# EAGLE design Schematico (EAGLE 7.2.0)
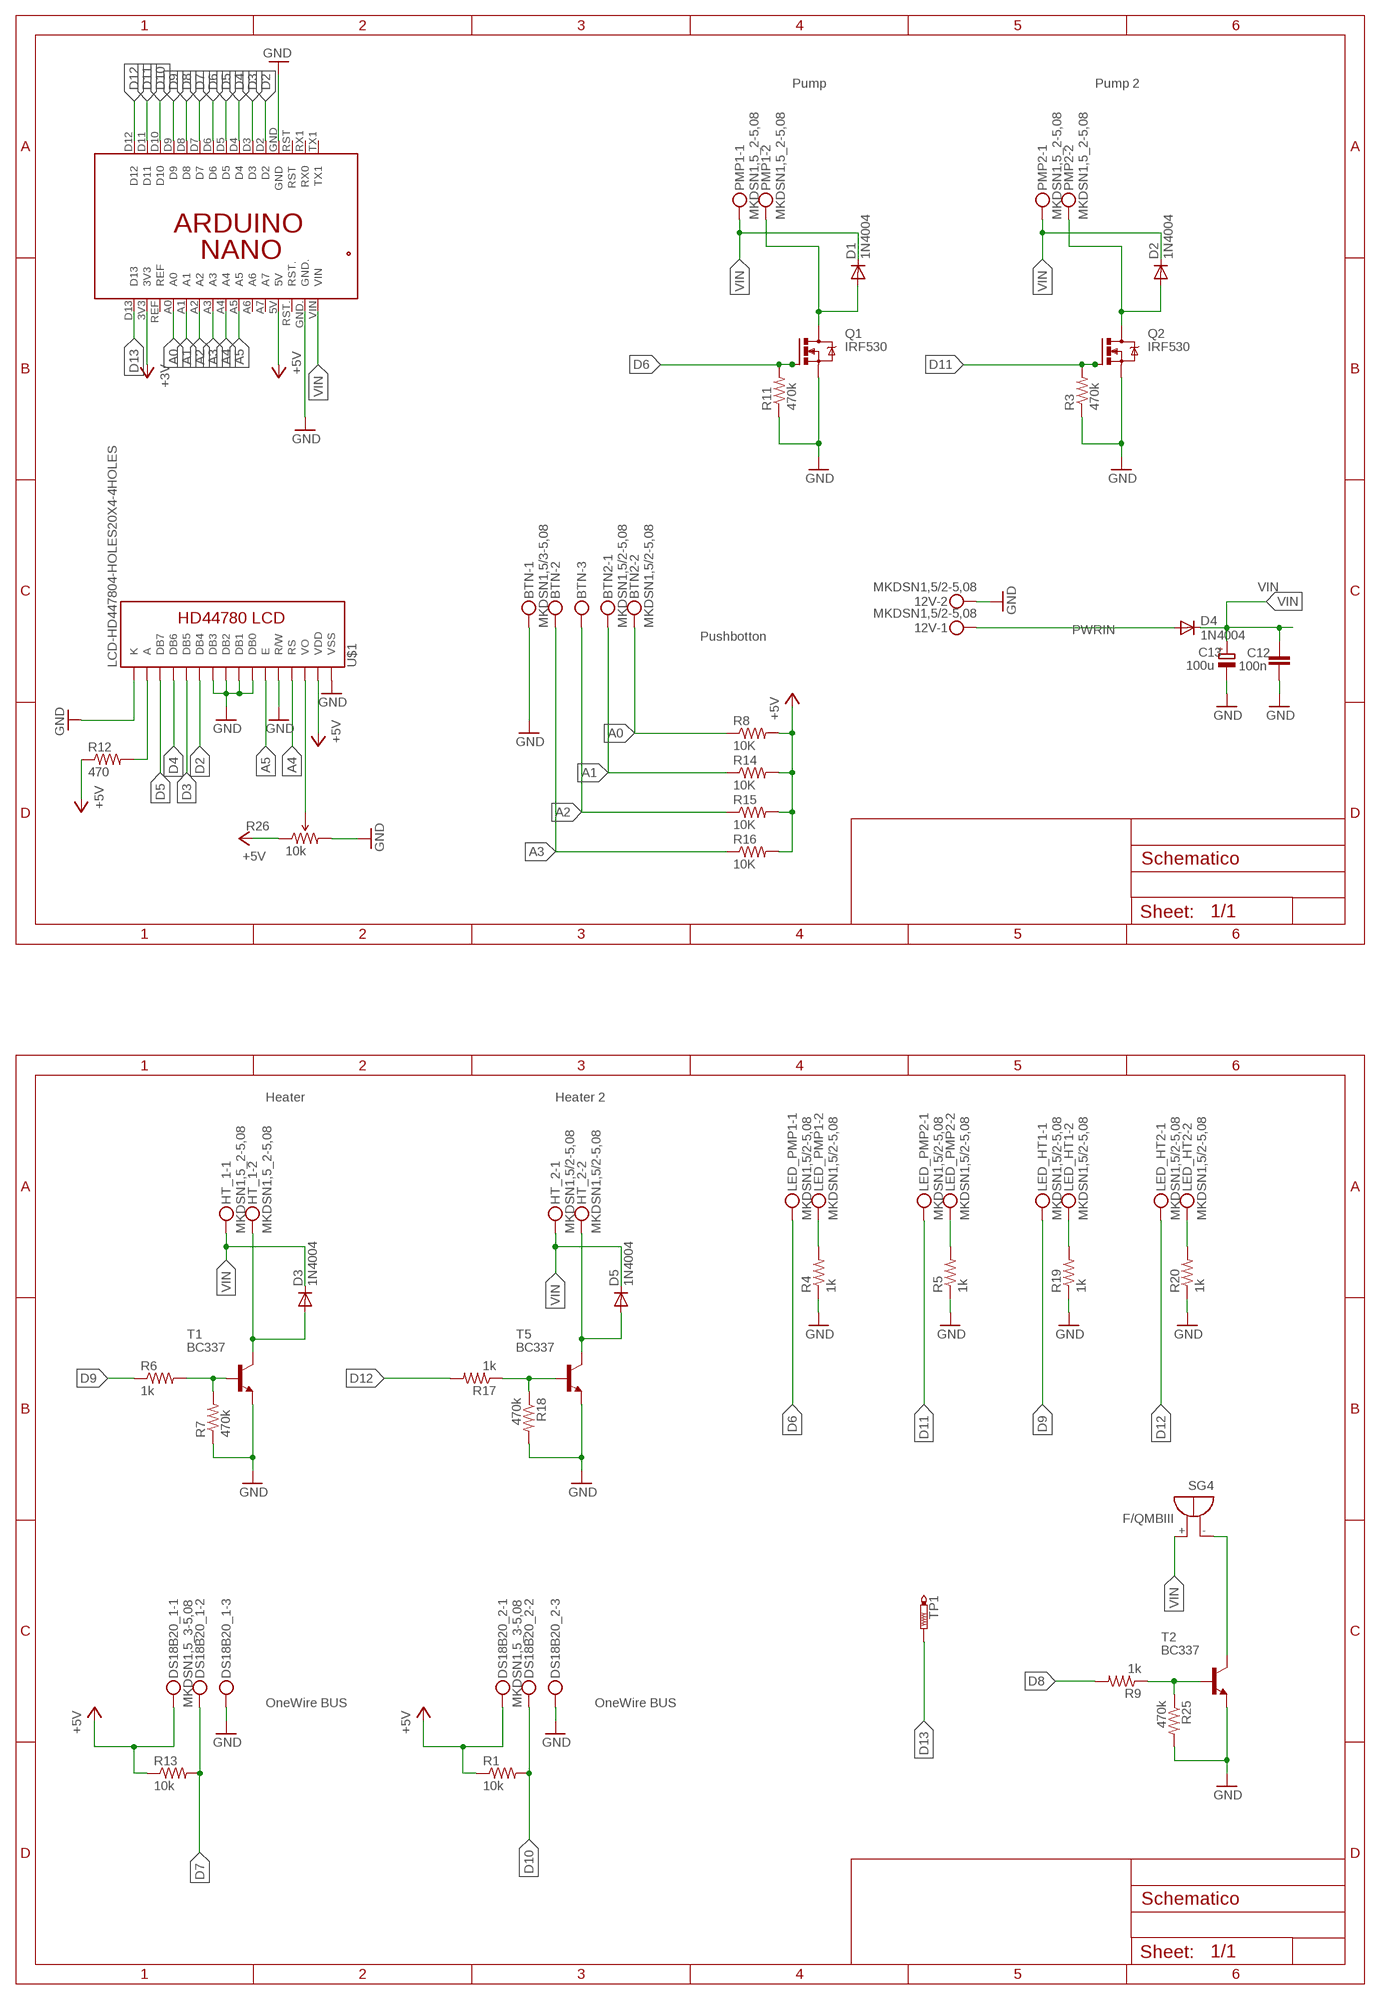
[diagram p0: schematic, sheet 1]

## Parts
12V  MKDSN1,5/2-5,08  [MKDSN1,5/2-5,08]
BTN  MKDSN1,5/3-5,08  [MKDSN1,5/3-5,08]
BTN2  MKDSN1,5/2-5,08  [MKDSN1,5/2-5,08]
C12  100n  C-EU050-024X044  [C050-024X044]
C13  100u  CPOL-EUTT6D6  [TT5D6]
D1  1N4004  [DO41-10]
D2  1N4004  [DO41-10]
D3  1N4004  [DO41-10]
D4  1N4004  [DO41-10]
D5  1N4004  [DO41-10]
DS18B20_1  MKDSN1,5_3-5,08  [MKDSN1,5-3-5,08]
DS18B20_2  MKDSN1,5_3-5,08  [MKDSN1,5-3-5,08]
HT_1  MKDSN1,5_2-5,08  [MKDSN1,5-2-5,08]
HT_2  MKDSN1,5/2-5,08  [MKDSN1,5/2-5,08]
LED_HT1  MKDSN1,5/2-5,08  [MKDSN1,5/2-5,08]
LED_HT2  MKDSN1,5/2-5,08  [MKDSN1,5/2-5,08]
LED_PMP1  MKDSN1,5/2-5,08  [MKDSN1,5/2-5,08]
LED_PMP2  MKDSN1,5/2-5,08  [MKDSN1,5/2-5,08]
PCB1  ARDUINO_NANO  [ARDUINO_NANO]
PMP1  MKDSN1,5_2-5,08  [MKDSN1,5-2-5,08]
PMP2  MKDSN1,5_2-5,08  [MKDSN1,5-2-5,08]
Q1  IRF530  [TO220BV]
Q2  IRF530  [TO220BV]
R1  10k  R-US_0207/10  [0207/10]
R3  470k  R-US_0207/10  [0207/10]
R4  1k  R-US_0207/10  [0207/10]
R5  1k  R-US_0207/10  [0207/10]
R6  1k  R-US_0207/10  [0207/10]
R7  470k  R-US_0207/10  [0207/10]
R8  10K  R-US_0207/10  [0207/10]
R9  1k  R-US_0207/10  [0207/10]
R11  470k  R-US_0207/10  [0207/10]
R12  470  R-US_0207/10  [0207/10]
R13  10k  R-US_0207/10  [0207/10]
R14  10K  R-US_0207/10  [0207/10]
R15  10K  R-US_0207/10  [0207/10]
R16  10K  R-US_0207/10  [0207/10]
R17  1k  R-US_0207/10  [0207/10]
R18  470k  R-US_0207/10  [0207/10]
R19  1k  R-US_0207/10  [0207/10]
R20  1k  R-US_0207/10  [0207/10]
R25  470k  R-US_0207/10  [0207/10]
R26  10k  TRIMPOT3362U-2  [3362U-2]
SG4  F/QMBIII  [F/QMBIII]
T1  BC337  [TO92]
T2  BC337  [TO92]
T5  BC337  [TO92]
TP1  PTR1PAD1-20  [P1-20]
U$1  LCD-HD447804-HOLES20X4-4HOLES  [LCD-20X4-4HOLES]

## Nets
+3V: PCB1.3V3
+5V [+5V]: DS18B20_1.1 DS18B20_2.1 PCB1.5V R1.1 R8.2 R12.1 R13.1 R14.2 R15.2 R16.2 R26.1(CCW) U$1.P$2(VDD)
A0: BTN2.2 PCB1.A0 R8.1
A1: BTN2.1 PCB1.A1 R14.1
A2: BTN.3 PCB1.A2 R15.1
A3: BTN.2 PCB1.A3 R16.1
A4: PCB1.A4 U$1.P$4(RS)
A5: PCB1.A5 U$1.P$6(E)
D2: PCB1.D2 U$1.P$11(DB4)
D3: PCB1.D3 U$1.P$12(DB5)
D4: PCB1.D4 U$1.P$13(DB6)
D5: PCB1.D5 U$1.P$14(DB7)
D6: LED_PMP1.1 PCB1.D6 Q1.G R11.2
D7: DS18B20_1.2 PCB1.D7 R13.2
D8: PCB1.D8 R9.2
D9: LED_HT1.1 PCB1.D9 R6.1
D10: DS18B20_2.2 PCB1.D10 R1.2
D11: LED_PMP2.1 PCB1.D11 Q2.G R3.2
D12: LED_HT2.1 PCB1.D12 R17.2
D13: PCB1.D13 TP1.TP
GND: 12V.2 BTN.1 C12.1 C13.- DS18B20_1.3 DS18B20_2.3 PCB1.GND PCB1.GND. Q1.S Q2.S R3.1 R4.1 R5.1 R7.1 R11.1 R18.2 R19.1 R20.1 R25.2 R26.3(CW) T1.1(E) T2.1(E) T5.1(E) U$1.P$1(VSS) U$1.P$5(R/W) U$1.P$7(DB0) U$1.P$8(DB1) U$1.P$9(DB2) U$1.P$10(DB3) U$1.P$16(K)
N$2: D2.A PMP2.2 Q2.D
N$3: LED_PMP1.2 R4.2
N$4: LED_PMP2.2 R5.2
N$6: D1.A PMP1.2 Q1.D
N$7: SG4.-(+) T2.3(C)
N$8: R9.1 R25.1 T2.2(B)
N$10: R12.2 U$1.P$15(A)
N$11: D3.A HT_1.2 T1.3(C)
N$12: R26.2(WIPER) U$1.P$3(VO)
N$13: R6.2 R7.2 T1.2(B)
N$35: D5.A HT_2.2 T5.3(C)
N$36: R17.1 R18.1 T5.2(B)
N$37: LED_HT1.2 R19.2
N$39: LED_HT2.2 R20.2
PWRIN [PWRIN]: 12V.1 D4.A
VIN [PWRIN]: C12.2 C13.+ D1.C D2.C D3.C D4.C D5.C HT_1.1 HT_2.1 PCB1.VIN PMP1.1 PMP2.1 SG4.+(-)
Unconnected: PCB1.A6 PCB1.A7 PCB1.REF PCB1.RST PCB1.RST. PCB1.RX1(RX0) PCB1.TX1

## Notes on the sheet
- Pump | Pump 2
- Pushbotton
- Heater | Heater 2
- OneWire BUS | OneWire BUS

## Library data of the parts
12V BTN2 = con-phoenix-508:MKDSN1,5/2-5,08: MKDSN 1,5/ 2-5,08 Printklemme Nennstrom: 13,5 A Nennspannung: 250 V Rastermaß: 5,08 mm Polzahl: 2 Anschlussart: Schraubanschluss Montage: Löten Anschlussrichtung Leiter/Platine: 0 ° Artikelnummer: 1729128 Source: http://eshop.phoenixcontact.com .. 1729128.pdf; OC_NEWARK: unknown
BTN = con-phoenix-508:MKDSN1,5/3-5,08: MKDSN 1,5/ 3-5,08 Printklemme Nennstrom: 13,5 A Nennspannung: 250 V Rastermaß: 5,08 mm Polzahl: 3 Anschlussart: Schraubanschluss Montage: Löten Anschlussrichtung Leiter/Platine: 0 ° Artikelnummer: 1729131 Source: http://eshop.phoenixcontact.com .. 1729131.pdf; OC_NEWARK: unknown
C12 = rcl:C-EU: CAPACITOR, European symbol
C13 = rcl:CPOL-EU: POLARIZED CAPACITOR, European symbol
D1-D5 = diode:1N4004: DIODE general purpose rectifier, 1 A
DS18B20_1 DS18B20_2 = con-phoenix-508:MKDSN1,5_3-5,08: MKDSN 1,5/ 3-5,08 Printklemme Nennstrom: 13,5 A Nennspannung: 250 V Rastermaß: 5,08 mm Polzahl: 3 Anschlussart: Schraubanschluss Montage: Löten Anschlussrichtung Leiter/Platine: 0 ° Artikelnummer: 1729131 Source: http://eshop.phoenixcontact.com .. 1729131.pdf; OC_NEWARK: unknown
HT_1 PMP1 PMP2 = con-phoenix-508:MKDSN1,5_2-5,08: MKDSN 1,5/ 2-5,08 Printklemme Nennstrom: 13,5 A Nennspannung: 250 V Rastermaß: 5,08 mm Polzahl: 2 Anschlussart: Schraubanschluss Montage: Löten Anschlussrichtung Leiter/Platine: 0 ° Artikelnummer: 1729128 Source: http://eshop.phoenixcontact.com .. 1729128.pdf; OC_NEWARK: unknown
HT_2 LED_HT1 LED_HT2 LED_PMP1 LED_PMP2 = con-phoenix-508:MKDSN1,5/2-5,08: MKDSN 1,5/ 2-5,08 Printklemme Nennstrom: 13,5 A Nennspannung: 250 V Rastermaß: 5,08 mm Polzahl: 2 Anschlussart: Schraubanschluss Montage: Löten Anschlussrichtung Leiter/Platine: 0 ° Artikelnummer: 1729128 Source: http://eshop.phoenixcontact.com .. 1729128.pdf
PCB1 = E14_Arduino_revB:ARDUINO_NANO: Device for representing an Arduino Nano board with a footprint in an EAGLE design. Created by Dave Young for Element14. More EAGLE documentation at: http://www.element14.com/community/community/knode/cadsoft_eagle
Q1 Q2 = transistor-power:IRF530: HEXFET Power MOSFET
R1 R3-R9 R11-R20 R25 = resistor:R-US_: RESISTOR, American symbol; OC_NEWARK: unknown
R26 = SparkFun-Electromechanical:TRIMPOT: Various small potentiometers for "set-and-forget" applications
SG4 = buzzer:F/QMBIII: BUZZER Source: Buerklin; OC_FARNELL: unknown; OC_NEWARK: unknown
T1 T2 T5 = transistor-neu-to92:BC337: NPN TRANSISTOR
TP1 = testpad:PTR1: TEST PIN
U$1 = HD44780LCD:LCD-HD44780

## Net classes
0 default: width 0.254 mm, clearance 0.254 mm
1 PWRIN: width 0.61 mm, drill 0.508 mm, clearance 0.205 mm to class 0, clearance 0.254 mm
4 +5V: width 0.406 mm, drill 0.508 mm, clearance 0.205 mm to class 0, clearance 0.205 mm to class 1, clearance 0.205 mm to class 2, clearance 0.205 mm to class 3, clearance 0.254 mm

## Board
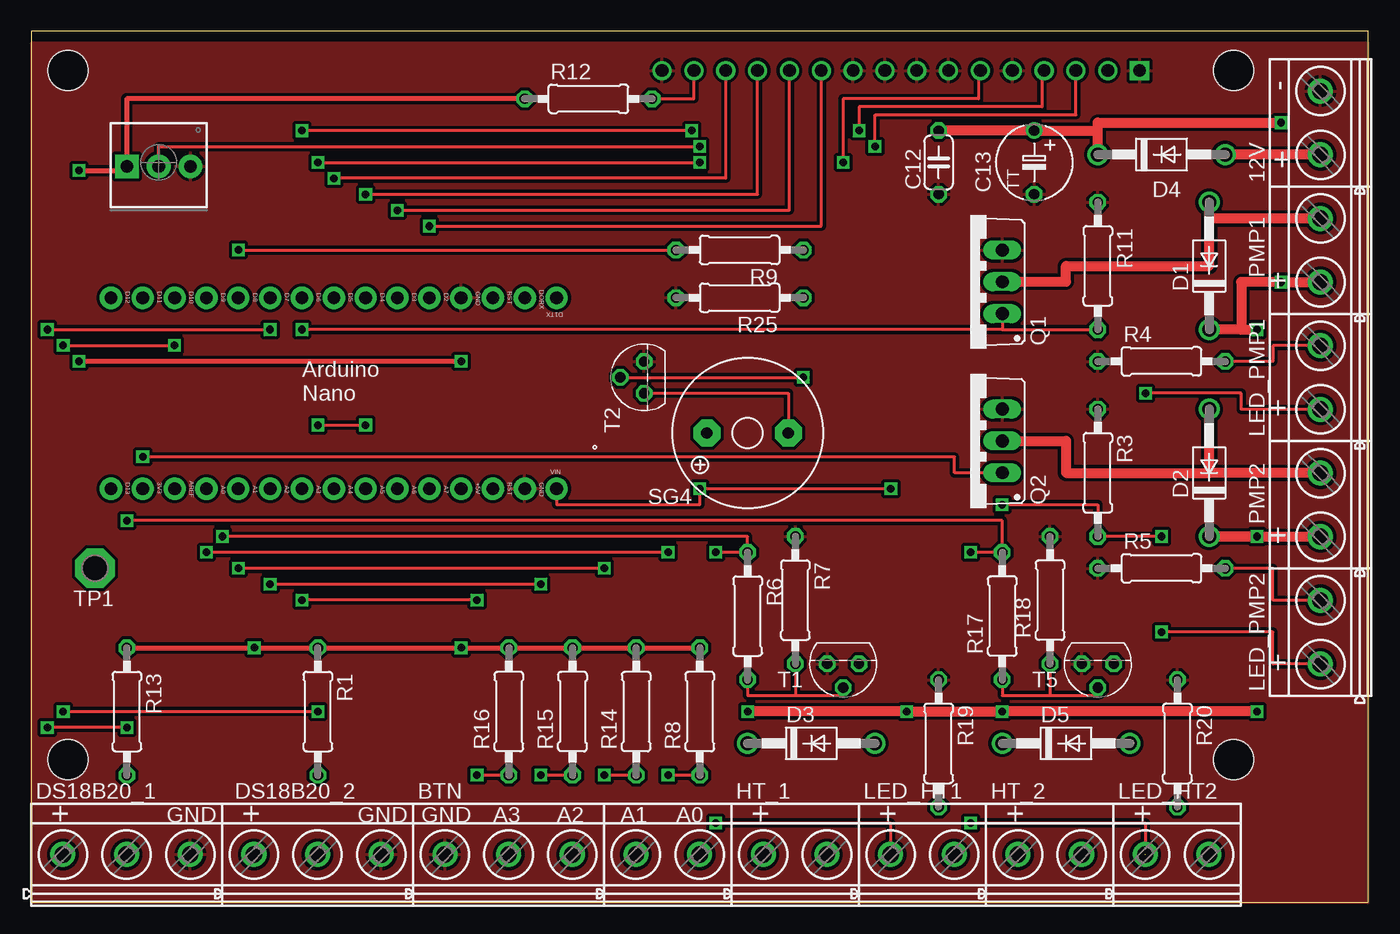
[diagram p1: board, top side]
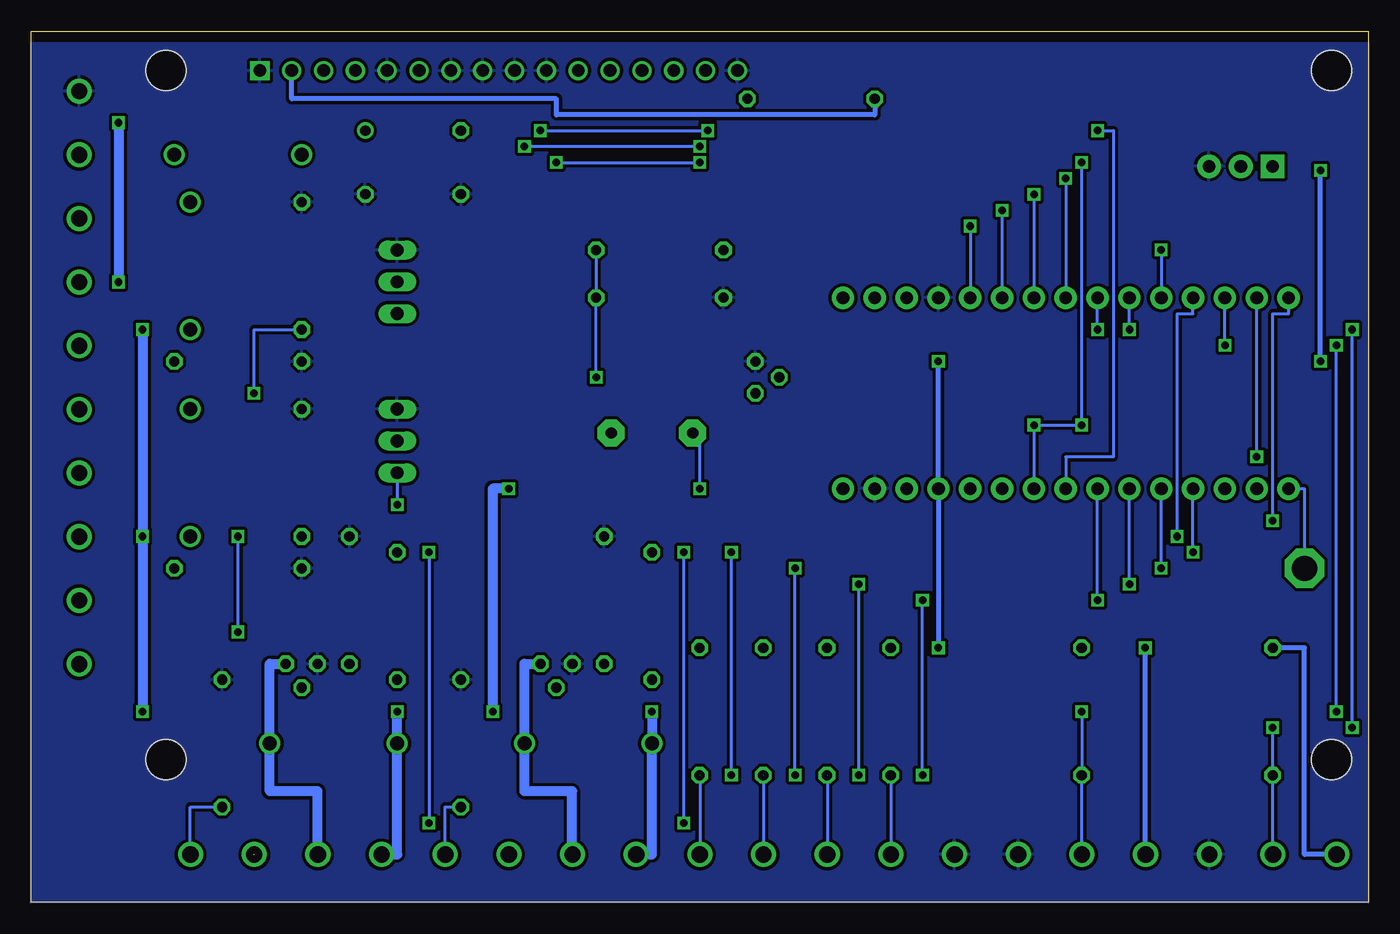
[diagram p2: board, bottom side, seen from below]

Size 106.66 x 69.52 mm. Coordinates in mm from the lower left corner, seen from the top.
Outline: 0,0 106.66,0 106.66,69.52 0,69.52 0,0
Copper layers (1*16): Top 0.035mm / dielectric 1.5mm / Bottom 0.035mm
Design rules "default *": minimum track width 10mil, minimum drill 16mil, track to track 8mil, track to pad 8mil, pad to pad 8mil, via to via 8mil, smd to smd 8mil, copper to edge 0mil, drill to drill 8mil, minimum pad ring 10mil, minimum via ring 8mil, stop-mask expansion 4mil, vias tented up to drill 0mil, thermal gap 10mil

### Footprints (pad centres in the part's own frame; a part is rotated, then mirrored left to right if it is on the bottom)
MKDSN1,5/2-5,08 = drill 1.3 pad 2: 1 -2.561,0.025; 2 2.519,0.025
MKDSN1,5/3-5,08 = drill 1.3 pad 2: 1 -7.641,0.025; 2 -2.561,0.025; 3 2.519,0.025
C050-024X044 = drill 0.813 octagon: 1 -2.54,0; 2 2.54,0
TT5D6 = drill 0.813: + -2.54,0 | drill 0.813 octagon: - 2.54,0
DO41-10 = drill 1.118: A 5.08,0; C -5.08,0
MKDSN1,5-3-5,08 = drill 1.3 pad 2: 1 -7.641,0.025; 2 -2.561,0.025; 3 2.519,0.025
MKDSN1,5-2-5,08 = drill 1.3 pad 2: 1 -2.561,0.025; 2 2.519,0.025
ARDUINO_NANO = drill 1.016 pad 1.778: 3V3 6.35,1.27; 5V 31.75,1.27; A0 11.43,1.27; A1 13.97,1.27; A2 16.51,1.27; A3 19.05,1.27; A4 21.59,1.27; A5 24.13,1.27; A6 26.67,1.27; A7 29.21,1.27; D2 29.21,16.51; D3 26.67,16.51; D4 24.13,16.51; D5 21.59,16.51; D6 19.05,16.51; D7 16.51,16.51; D8 13.97,16.51; D9 11.43,16.51; D10 8.89,16.51; D11 6.35,16.51; D12 3.81,16.51; D13 3.81,1.27; GND 31.75,16.51; GND. 36.83,1.27; REF 8.89,1.27; RST 34.29,16.51; RST. 34.29,1.27; RX1 36.83,16.51; TX1 39.37,16.51; VIN 39.37,1.27
TO220BV = drill 1.016 long: D 0,-2.54; G -2.54,-2.54; S 2.54,-2.54
0207/10 = drill 0.813 octagon: 1 -5.08,0; 2 5.08,0
3362U-2 = drill 1.016 pad 1.88 square: 1 -2.54,-0.305 | drill 1.016 pad 1.88: 2 0,-0.305; 3 2.54,-0.305
F/QMBIII = drill 0.914 pad 2.159 octagon: + 3.251,0; - -3.251,0
TO92 = drill 0.813 octagon: 1 1.27,0; 2 0,1.905; 3 -1.27,0
P1-20 = drill 2.007 pad 3.15 octagon: TP 0,0
LCD-20X4-4HOLES = drill 1.016 square: P$1 10,57.5 | drill 1.016: P$2 12.54,57.5; P$3 15.08,57.5; P$4 17.62,57.5; P$5 20.16,57.5; P$6 22.7,57.5; P$7 25.24,57.5; P$8 27.78,57.5; P$9 30.32,57.5; P$10 32.86,57.5; P$11 35.4,57.5; P$12 37.94,57.5; P$13 40.48,57.5; P$14 43.02,57.5; P$15 45.56,57.5; P$16 48.1,57.5 | hole 3.2: 2.5,2.5; 2.5,57.5; 95.5,57.5; 95.5,2.5

### Placement (x,y rotation side)
12V  102.87,62.23 90 top
BTN  40.64,3.81 0 top
BTN2  50.8,3.81 0 top
C12  72.39,59.05 90 top
C13  80.01,59.05 270 top
D1  93.98,50.8 90 top
D2  93.98,34.29 90 top
D3  62.23,12.7 0 top
D4  90.17,59.69 0 top
D5  82.55,12.7 0 top
DS18B20_1  10.16,3.81 0 top
DS18B20_2  25.4,3.81 0 top
HT_1  60.96,3.81 0 top
HT_2  81.28,3.81 0 top
LED_HT1  71.12,3.81 0 top
LED_HT2  91.44,3.81 0 top
LED_PMP1  102.87,41.91 90 top
LED_PMP2  102.87,21.59 90 top
PCB1  2.54,31.75 0 top
PMP1  102.87,52.07 90 top
PMP2  102.87,31.75 90 top
Q1  74.93,49.53 90 top
Q2  74.93,36.83 90 top
R1  22.86,15.24 270 top
R3  85.09,34.29 270 top
R4  90.17,43.18 0 top
R5  90.17,26.67 0 top
R6  57.15,22.86 270 top
R7  60.96,24.13 270 top
R8  53.34,15.24 90 top
R9  56.51,52.07 180 top
R11  85.09,50.8 270 top
R12  44.45,64.14 0 top
R13  7.62,15.24 270 top
R14  48.26,15.24 90 top
R15  43.18,15.24 90 top
R16  38.1,15.24 90 top
R17  77.47,22.86 90 top
R18  81.28,24.13 90 top
R19  72.39,12.7 270 top
R20  91.44,12.7 270 top
R25  56.51,48.26 180 top
R26  10.16,59.05 0 top
SG4  57.15,37.46 180 top
T1  64.77,19.05 180 top
T2  48.9,41.91 90 top
T5  85.09,19.05 180 top
TP1  5.08,26.67 180 top
U$1  98.43,8.89 0 bottom

### Tracks (layer width: path | path; a pad name or v marks a point on that pad's centre or on a via)
+5V  (via drill 0.6)  (1 unrouted)
  Top 0.406: R13.1 v17.78,20.32 R1.1 v34.29,20.32 R16.2 R15.2 R14.2 R8.2 | v34.29,43.18 v3.81,43.18 | v3.81,58.42 7.62,58.42 R26.1 7.62,64.14 R12.1
  Bottom 0.406: DS18B20_1.1 5.08,3.83 5.08,20.32 R13.1 | DS18B20_2.1 17.78,3.83 v17.78,20.32 | v34.29,20.32 PCB1.5V v34.29,43.18 | v3.81,43.18 v3.81,58.42 | R12.1 39.37,62.86 64.77,62.86 64.77,64.14 85.89,64.14 U$1.P$2
A0  (via drill 0.6)  (1 unrouted)
  Top 0.254: 53.32,10.16 v50.8,10.16 | v50.8,27.94 v13.97,27.94
  Bottom 0.254: R8.1 53.32,10.16 BTN2.2 | v50.8,10.16 v50.8,27.94 | v13.97,27.94 PCB1.A0
A1  (via drill 0.6)  (1 unrouted)
  Top 0.254: 48.24,10.16 v45.72,10.16 | v45.72,26.67 v16.51,26.67
  Bottom 0.254: R14.1 48.24,10.16 BTN2.1 | v45.72,10.16 v45.72,26.67 | v16.51,26.67 PCB1.A1
A2  (via drill 0.6)  (1 unrouted)
  Top 0.254: 43.16,10.16 v40.64,10.16 | v40.64,25.4 v19.05,25.4
  Bottom 0.254: R15.1 43.16,10.16 BTN.3 | v40.64,10.16 v40.64,25.4 | v19.05,25.4 PCB1.A2
A3  (via drill 0.6)
  Top 0.254: R16.1 v35.56,10.16 | v35.56,24.13 v21.59,24.13
  Bottom 0.254: R16.1 38.08,10.16 BTN.2 | v35.56,10.16 v35.56,24.13 | v21.59,24.13 PCB1.A3
A4  (via drill 0.6)
  Top 0.254: U$1.P$4 80.65,66.39 80.65,63.5 66.04,63.5 v66.04,61.59 | v52.7,61.59 v21.59,61.59
  Bottom 0.254: v66.04,61.59 v52.7,61.59 | v21.59,61.59 20.32,61.59 20.32,35.56 24.13,35.56 PCB1.A4
A5  (via drill 0.6)
  Top 0.254: v22.86,38.1 v26.67,38.1 | v22.86,59.05 v53.34,59.05 | U$1.P$6 75.57,66.39 75.57,64.14 64.77,64.14 v64.77,59.05
  Bottom 0.254: PCB1.A5 v26.67,38.1 v22.86,38.1 v22.86,59.05 | v64.77,59.05 v53.34,59.05
D2  (via drill 0.6)
  Top 0.254: v31.75,53.98 63.02,53.98 U$1.P$11
  Bottom 0.254: v31.75,53.98 PCB1.D2
D3  (via drill 0.6)
  Top 0.254: v29.21,55.24 60.48,55.24 U$1.P$12
  Bottom 0.254: v29.21,55.24 PCB1.D3
D4  (via drill 0.6)
  Top 0.254: v26.67,56.52 57.95,56.52 U$1.P$13
  Bottom 0.254: v26.67,56.52 PCB1.D4
D5  (via drill 0.6)
  Top 0.254: v24.13,57.78 55.4,57.78 U$1.P$14
  Bottom 0.254: v24.13,57.78 PCB1.D5
D6  (via drill 0.6)
  Top 0.254: 77.47,45.72 v21.59,45.72 | LED_PMP1.1 96.54,39.35 96.52,39.37 96.52,40.64 v88.9,40.64 | Q1.G 77.47,45.72 | 77.47,45.72 R11.2
  Bottom 0.254: v21.59,45.72 PCB1.D6 | v88.9,40.64 88.9,45.72 R11.2
D7  (via drill 0.6)
  Top 0.254: v1.27,45.72 v19.05,45.72 | v7.62,13.97 v1.27,13.97
  Bottom 0.254: DS18B20_1.2 7.62,3.83 R13.2 v7.62,13.97 | v1.27,13.97 v1.27,45.72 | v19.05,45.72 PCB1.D7
D8  (via drill 0.6)
  Top 0.254: v16.51,52.07 R9.2
  Bottom 0.254: v16.51,52.07 PCB1.D8
D9  (via drill 0.6)
  Top 0.254: v15.24,29.21 57.15,29.21 R6.1 v54.61,27.94 | LED_HT1.1 68.56,6.35 v54.61,6.35
  Bottom 0.254: v15.24,29.21 15.24,46.99 13.97,46.99 PCB1.D9 | v54.61,27.94 v54.61,6.35
D10  (via drill 0.6)
  Top 0.254: v2.54,44.45 v11.43,44.45 | v2.54,15.24 v22.86,15.24
  Bottom 0.254: DS18B20_2.2 22.86,3.83 R1.2 v22.86,15.24 | v2.54,15.24 v2.54,44.45 | v11.43,44.45 PCB1.D10
D11  (via drill 0.6)
  Top 0.254: Q2.G 73.66,34.29 73.66,35.56 v8.89,35.56 | LED_PMP2.1 99.08,19.03 99.06,19.05 99.06,21.59 v90.17,21.59 | v90.17,29.21 R3.2 85.09,31.75 v77.47,31.75
  Bottom 0.254: v8.89,35.56 PCB1.D11 | v90.17,21.59 v90.17,29.21 | Q2.G v77.47,31.75
D12  (via drill 0.6)  (1 unrouted)
  Top 0.254: v7.62,30.48 77.47,30.48 R17.2 v74.93,27.94 | 88.9,3.81 88.9,6.35 v74.93,6.35
  Bottom 0.254: v7.62,30.48 7.62,46.99 6.35,46.99 PCB1.D12 | v74.93,27.94 v74.93,6.35
D13
  Bottom 0.254: PCB1.D13 5.08,33.02 TP1.TP
GND
  pour Bottom: 0,68.58 0,0 106.68,0 106.68,68.58
  pour Top: 0,68.58 0,0 106.68,0 106.68,68.58
N$2
  Top 0.61: 93.98,34.27 93.98,34.29
  Top 0.813: Q2.D 82.55,36.83 82.55,34.29 93.98,34.29 D2.A | PMP2.2 93.98,34.27
N$3
  Top 0.254: LED_PMP1.2 99.06,44.43 99.06,43.18 R4.2
N$4
  Top 0.254: LED_PMP2.2 99.06,24.11 99.06,26.67 R5.2
N$6
  Top 0.61: 93.98,54.59 93.98,54.61
  Top 0.813: Q1.D 82.55,49.53 82.55,50.8 93.98,50.8 93.98,54.59 PMP1.2 | 93.98,54.61 D1.A
N$7
  Top 0.254: T2.3 60.4,40.64 SG4.-
N$8  (via drill 0.6)
  Top 0.254: T2.2 v61.59,41.91
  Bottom 0.254: R9.1 R25.1 v61.59,41.91
N$10
  Top 0.254: R12.2 52.87,64.14 U$1.P$15
N$11
  Bottom 0.61: HT_1.2 63.5,3.83
  Bottom 0.813: 63.5,3.83 63.5,8.89 67.31,8.89 D3.A 67.31,19.05 T1.3
N$12  (via drill 0.6)
  Top 0.254: R26.2 10.16,60.32 v53.34,60.32 | v67.31,60.32 67.31,62.86 83.34,62.86 U$1.P$3
  Bottom 0.254: v53.34,60.32 v67.31,60.32
N$13
  Top 0.254: R6.2 57.15,16.51 60.96,16.51 | 60.96,16.51 64.77,16.51 T1.2 | R7.2 60.96,16.51
N$35
  Bottom 0.61: HT_2.2 83.82,3.83
  Bottom 0.813: 83.82,3.83 83.82,8.89 87.63,8.89 D5.A 87.63,19.05 T5.3
N$36
  Top 0.254: R17.1 77.47,16.51 81.28,16.51 | 81.28,16.51 85.09,16.51 T5.2 | R18.1 81.28,16.51
N$37
  Bottom 0.254: LED_HT1.2 73.66,3.83 73.66,7.62 R19.2
N$39
  Bottom 0.254: LED_HT2.2 93.98,3.83 93.98,7.62 R20.2
PWRIN
  Top 0.813: 12V.1 95.25,59.67 D4.A
VIN  (via drill 0.6)
  Top 0.254: v68.58,33.02 v53.34,33.02 53.34,31.75 41.91,31.75 PCB1.VIN
  Top 0.61: 97.79,29.19 96.52,29.19 96.52,29.21 D2.C
  Top 0.813: C12.2 C13.+ 85.09,61.59 | PMP2.1 97.79,29.19 97.77,29.21 D2.C v97.79,29.21 | 102.84,49.53 PMP1.1 v99.7,49.51 96.52,49.51 96.52,45.72 | 96.52,45.72 D1.C | v57.15,15.24 v69.85,15.24 v77.47,15.24 v97.79,15.24 | 96.52,45.72 v97.79,45.72 | v99.7,62.23 85.09,62.23 85.09,61.59 | D4.C 85.09,61.59
  Bottom 0.254: SG4.+ 53.34,37.46 v53.34,33.02
  Bottom 0.813: HT_1.1 57.15,3.83 D3.C v57.15,15.24 | HT_2.1 77.47,3.83 D5.C v77.47,15.24 | v68.58,33.02 69.85,33.02 v69.85,15.24 | v97.79,45.72 v97.79,29.21 | v97.79,29.21 97.79,29.19 | v97.79,29.21 v97.79,15.24 | v99.7,62.23 v99.7,49.51

### Text on the board
tNames: - | + | + | + | + | + | + | GND | + | GND | GND | A3 | A2 | A1 | A0 | + | + | + | +